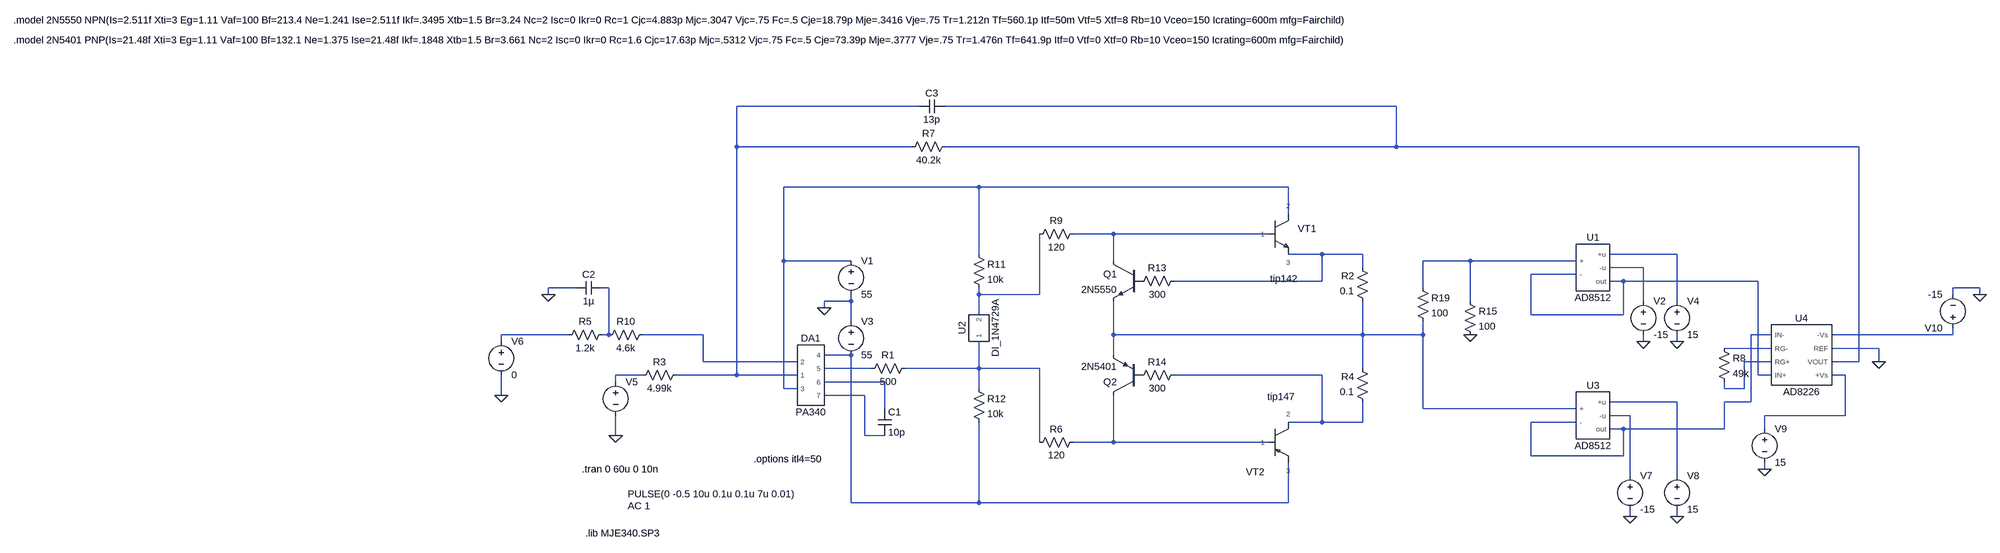
[diagram p0: schematic Draft15mk1.asc]
Draft15mk1.asc, the LTspice schematic file:
Version 4.1
SHEET 1 3012 1016
WIRE 448 -480 16 -480
WIRE 1584 -480 512 -480
WIRE 16 -384 16 -480
WIRE 432 -384 16 -384
WIRE 1584 -384 1584 -480
WIRE 1584 -384 512 -384
WIRE 2704 -384 1584 -384
WIRE 592 -288 128 -288
WIRE 1328 -288 592 -288
WIRE 1328 -224 1328 -288
WIRE 912 -176 816 -176
WIRE 1280 -176 912 -176
WIRE 592 -128 592 -288
WIRE 1408 -128 1328 -128
WIRE 1504 -128 1408 -128
WIRE 2272 -128 2112 -128
WIRE 128 -112 128 -288
WIRE 288 -112 128 -112
WIRE 912 -112 912 -176
WIRE 1760 -112 1648 -112
WIRE 2032 -112 1760 -112
WIRE 1504 -96 1504 -128
WIRE 2192 -96 2112 -96
WIRE 2032 -80 1904 -80
WIRE 1408 -64 1408 -128
WIRE 1408 -64 1056 -64
WIRE 2144 -64 2112 -64
WIRE 2464 -64 2144 -64
WIRE -368 -48 -432 -48
WIRE -288 -48 -304 -48
WIRE 1648 -48 1648 -112
WIRE 2992 -48 2928 -48
WIRE -432 -32 -432 -48
WIRE 592 -32 592 -48
WIRE 736 -32 736 -176
WIRE 736 -32 592 -32
WIRE 2928 -32 2928 -48
WIRE 2992 -32 2992 -48
WIRE 288 -16 288 -32
WIRE 288 -16 224 -16
WIRE 1760 -16 1760 -112
WIRE 2192 -16 2192 -96
WIRE 2272 -16 2272 -128
WIRE 224 0 224 -16
WIRE 592 16 592 -32
WIRE 1904 16 1904 -80
WIRE 2144 16 2144 -64
WIRE 2144 16 1904 16
WIRE 288 32 288 -16
WIRE -384 64 -544 64
WIRE -288 64 -288 -48
WIRE -288 64 -304 64
WIRE -64 64 -208 64
WIRE 912 64 912 -16
WIRE 1504 64 1504 -16
WIRE 1504 64 912 64
WIRE 1648 64 1648 32
WIRE 1648 64 1504 64
WIRE 2496 64 2448 64
WIRE 2928 64 2928 48
WIRE 2928 64 2640 64
WIRE -544 80 -544 64
WIRE 2192 80 2192 64
WIRE 2272 80 2272 64
WIRE 2496 96 2384 96
WIRE 2752 96 2640 96
WIRE 288 112 224 112
WIRE 912 112 912 64
WIRE -64 128 -64 64
WIRE 160 128 -64 128
WIRE 2496 128 2432 128
WIRE 2704 128 2704 -384
WIRE 2704 128 2640 128
WIRE 2752 128 2752 96
WIRE 336 144 224 144
WIRE 592 144 592 80
WIRE 592 144 416 144
WIRE 736 144 592 144
WIRE 1504 144 1504 64
WIRE -208 160 -272 160
WIRE 16 160 16 -384
WIRE 16 160 -128 160
WIRE 160 160 16 160
WIRE 1408 160 1056 160
WIRE 2464 160 2464 -64
WIRE 2496 160 2464 160
WIRE 2672 160 2640 160
WIRE -272 176 -272 160
WIRE 368 176 224 176
WIRE 128 192 128 -112
WIRE 160 192 128 192
WIRE 592 192 592 144
WIRE 2384 192 2384 176
WIRE 2432 192 2432 128
WIRE 2432 192 2384 192
WIRE -544 208 -544 160
WIRE 320 208 224 208
WIRE 2272 224 2112 224
WIRE 2448 224 2448 64
WIRE 2448 224 2384 224
WIRE 368 240 368 176
WIRE 1648 240 1648 64
WIRE 2032 240 1648 240
WIRE 2160 256 2112 256
WIRE 2672 256 2672 160
WIRE 2672 256 2480 256
WIRE 1408 272 1408 160
WIRE 1408 272 1328 272
WIRE 1504 272 1504 224
WIRE 1504 272 1408 272
WIRE 2032 272 1904 272
WIRE 2144 288 2112 288
WIRE 2384 288 2384 224
WIRE 2384 288 2144 288
WIRE 2480 288 2480 256
WIRE -272 304 -272 256
WIRE 320 304 320 208
WIRE 368 304 320 304
WIRE 736 320 736 144
WIRE 912 320 912 208
WIRE 912 320 816 320
WIRE 1280 320 912 320
WIRE 1904 352 1904 272
WIRE 2144 352 2144 288
WIRE 2144 352 1904 352
WIRE 2480 384 2480 368
WIRE 2160 400 2160 256
WIRE 2272 400 2272 224
WIRE 288 464 288 112
WIRE 592 464 592 272
WIRE 592 464 288 464
WIRE 1328 464 1328 368
WIRE 1328 464 592 464
WIRE 2160 496 2160 480
WIRE 2272 496 2272 480
FLAG -272 304 0
FLAG -432 -32 0
FLAG -544 208 0
FLAG 224 0 0
FLAG 2192 80 0
FLAG 2272 80 0
FLAG 2272 496 0
FLAG 2160 496 0
FLAG 2480 384 0
FLAG 2992 -32 0
FLAG 1760 64 0
FLAG 2752 128 0
SYMBOL PA340 192 160 R0
SYMATTR InstName DA1
SYMBOL res -112 144 R90
WINDOW 0 0 56 VBottom 2
WINDOW 3 32 56 VTop 2
SYMATTR InstName R3
SYMATTR Value 4.99k
SYMBOL cap 352 240 R0
SYMATTR InstName C1
SYMATTR Value 10p
SYMBOL res -192 48 R90
WINDOW 0 0 56 VBottom 2
WINDOW 3 32 56 VTop 2
SYMATTR InstName R10
SYMATTR Value 4.6k
SYMBOL voltage -272 160 R0
WINDOW 123 29 311 Left 2
WINDOW 39 0 0 Left 0
WINDOW 3 29 283 Left 2
SYMATTR Value2 AC 1
SYMATTR Value PULSE(0 -0.5 10u 0.1u 0.1u 7u 0.01)
SYMATTR InstName V5
SYMBOL res 832 304 R90
WINDOW 0 0 56 VBottom 2
WINDOW 3 62 56 VBottom 2
SYMATTR InstName R6
SYMATTR Value 120
SYMBOL tip142 1312 -176 R0
WINDOW 0 60 3 Bottom 2
WINDOW 3 5 91 Top 2
SYMATTR InstName VT1
SYMBOL tip147 1312 320 M180
WINDOW 0 -63 -55 Bottom 2
WINDOW 3 -1 93 Top 2
SYMATTR InstName VT2
SYMBOL res -288 48 R90
WINDOW 0 0 56 VBottom 2
WINDOW 3 32 56 VTop 2
SYMATTR InstName R5
SYMATTR Value 1.2k
SYMBOL cap -304 -64 R90
WINDOW 0 0 32 VBottom 2
WINDOW 3 32 32 VTop 2
SYMATTR InstName C2
SYMATTR Value 1µ
SYMBOL voltage -544 64 R0
WINDOW 123 0 0 Left 0
WINDOW 39 0 0 Left 0
SYMATTR InstName V6
SYMATTR Value 0
SYMBOL res 528 -400 R90
WINDOW 0 0 56 VBottom 2
WINDOW 3 32 56 VTop 2
SYMATTR InstName R7
SYMATTR Value 40.2k
SYMBOL res 832 -192 R90
WINDOW 0 0 56 VBottom 2
WINDOW 3 32 56 VTop 2
SYMATTR InstName R9
SYMATTR Value 120
SYMBOL cap 512 -496 R90
WINDOW 0 0 32 VBottom 2
WINDOW 3 32 32 VTop 2
SYMATTR InstName C3
SYMATTR Value 13p
SYMBOL voltage 288 16 R0
WINDOW 123 0 0 Left 0
WINDOW 39 0 0 Left 0
SYMATTR InstName V3
SYMATTR Value 55
SYMBOL voltage 288 -128 R0
WINDOW 123 0 0 Left 0
WINDOW 39 0 0 Left 0
SYMATTR InstName V1
SYMATTR Value 55
SYMBOL res 432 128 R90
WINDOW 0 0 56 VBottom 2
WINDOW 3 32 56 VTop 2
SYMATTR InstName R1
SYMATTR Value 500
SYMBOL res 1520 0 R180
WINDOW 0 36 76 Left 2
WINDOW 3 36 40 Left 2
SYMATTR InstName R2
SYMATTR Value 0.1
SYMBOL res 1520 240 R180
WINDOW 0 36 76 Left 2
WINDOW 3 36 40 Left 2
SYMATTR InstName R4
SYMATTR Value 0.1
SYMBOL res 576 -144 R0
SYMATTR InstName R11
SYMATTR Value 10k
SYMBOL res 576 176 R0
SYMATTR InstName R12
SYMATTR Value 10k
SYMBOL npn 976 -112 M0
SYMATTR InstName Q1
SYMATTR Value 2N5550
SYMBOL pnp 976 208 R180
SYMATTR InstName Q2
SYMATTR Value 2N5401
SYMBOL res 1072 -80 R90
WINDOW 0 0 56 VBottom 2
WINDOW 3 32 56 VTop 2
SYMATTR InstName R13
SYMATTR Value 300
SYMBOL res 1072 144 R90
WINDOW 0 0 56 VBottom 2
WINDOW 3 32 56 VTop 2
SYMATTR InstName R14
SYMATTR Value 300
SYMBOL DI_1N4729A 592 48 R270
SYMATTR InstName U2
SYMBOL AD8512 2064 -96 R0
SYMATTR InstName U1
SYMBOL voltage 2272 -32 R0
WINDOW 123 0 0 Left 0
WINDOW 39 0 0 Left 0
SYMATTR InstName V4
SYMATTR Value 15
SYMBOL AD8512 2064 256 R0
SYMATTR InstName U3
SYMBOL voltage 2272 384 R0
WINDOW 123 0 0 Left 0
WINDOW 39 0 0 Left 0
SYMATTR InstName V8
SYMATTR Value 15
SYMBOL voltage 2480 272 R0
WINDOW 123 0 0 Left 0
WINDOW 39 0 0 Left 0
SYMATTR InstName V9
SYMATTR Value 15
SYMBOL res 1744 -32 R0
SYMATTR InstName R15
SYMATTR Value 100
SYMBOL res 1632 -64 R0
SYMATTR InstName R19
SYMATTR Value 100
SYMBOL voltage 2192 -32 R0
WINDOW 123 0 0 Left 0
WINDOW 39 0 0 Left 0
SYMATTR InstName V2
SYMATTR Value -15
SYMBOL voltage 2160 384 R0
WINDOW 123 0 0 Left 0
WINDOW 39 0 0 Left 0
SYMATTR InstName V7
SYMATTR Value -15
SYMBOL voltage 2928 64 R180
WINDOW 123 0 0 Left 0
WINDOW 39 0 0 Left 0
SYMATTR InstName V10
SYMATTR Value -15
SYMBOL AD8226 2560 112 R0
SYMATTR InstName U4
SYMBOL res 2368 80 R0
SYMATTR InstName R8
SYMATTR Value 49k
TEXT -352 384 Left 2 !.tran 0 60u 0 10n
TEXT 56 360 Left 2 !.options itl4=50
TEXT -344 536 Left 2 !.lib MJE340.SP3
TEXT -1704 -824 Left 2 !.model 2N5550 NPN(Is=2.511f Xti=3 Eg=1.11 Vaf=100 Bf=213.4 Ne=1.241 Ise=2.511f Ikf=.3495 Xtb=1.5 Br=3.24 Nc=2 Isc=0 Ikr=0 Rc=1 Cjc=4.883p Mjc=.3047 Vjc=.75 Fc=.5 Cje=18.79p Mje=.3416 Vje=.75 Tr=1.212n Tf=560.1p Itf=50m Vtf=5 Xtf=8 Rb=10 Vceo=150 Icrating=600m mfg=Fairchild)
TEXT -1704 -776 Left 2 !.model 2N5401 PNP(Is=21.48f Xti=3 Eg=1.11 Vaf=100 Bf=132.1 Ne=1.375 Ise=21.48f Ikf=.1848 Xtb=1.5 Br=3.661 Nc=2 Isc=0 Ikr=0 Rc=1.6 Cjc=17.63p Mjc=.5312 Vjc=.75 Fc=.5 Cje=73.39p Mje=.3777 Vje=.75 Tr=1.476n Tf=641.9p Itf=0 Vtf=0 Xtf=0 Rb=10 Vceo=150 Icrating=600m mfg=Fairchild)

The netlist it stands for:
* Draft15mk1.asc
X§DA1 N013 N001 N003 N018 N020 N025 N026 PA340  ; pins 2 1 3 4 5 6 7
R3 N001 N022 4.99k
C1 N025 N026 10p
R10 N013 N010 4.6k
V5 N022 0 PULSE(0 -0.5 10u 0.1u 0.1u 7u 0.01) AC 1
R6 N029 N021 120
X§VT1 N003 N004 N005 tip142  ; pins 2 1 3
X§VT2 N018 N029 N023 tip147  ; pins 3 1 2
R5 N010 N012 1.2k
C2 N010 0 1µ
V6 N012 0 0
R7 N002 N001 40.2k
R9 N004 N011 120
C3 N002 N001 13p
V3 0 N018 55
V1 N003 0 55
R1 N021 N020 500
R2 N014 N005 0.1
R4 N023 N014 0.1
R11 N003 N011 10k
R12 N021 N018 10k
Q1 N004 P001 N014 0 2N5550
Q2 N029 P002 N014 0 2N5401
R13 N005 P001 300
R14 N023 P002 300
X§U2 N021 N011 DI_1N4729A  ; pins 1 2
X§U1 N007 N009 N006 N008 N009 AD8512  ; pins + - +u -u out
V4 N006 0 15
X§U3 N014 N015 N027 N028 N015 AD8512  ; pins + - +u -u out
V8 N027 0 15
V9 N024 0 15
R15 N007 0 100
R19 N007 N014 100
V2 N008 0 -15
V7 N028 0 -15
V10 N016 0 -15
X§U4 N015 N017 N019 N009 N016 0 N002 N024 AD8226  ; pins IN- RG- RG+ IN+ -Vs REF VOUT +Vs
R8 N017 N019 49k
.model NPN NPN
.model PNP PNP
.lib standard.bjt
.tran 0 60u 0 10n
.options itl4=50
.lib MJE340.SP3
.model 2N5550 NPN(Is=2.511f Xti=3 Eg=1.11 Vaf=100 Bf=213.4 Ne=1.241 Ise=2.511f Ikf=.3495 Xtb=1.5 Br=3.24 Nc=2 Isc=0 Ikr=0 Rc=1 Cjc=4.883p Mjc=.3047 Vjc=.75 Fc=.5 Cje=18.79p Mje=.3416 Vje=.75 Tr=1.212n Tf=560.1p Itf=50m Vtf=5 Xtf=8 Rb=10 Vceo=150 Icrating=600m mfg=Fairchild)
.model 2N5401 PNP(Is=21.48f Xti=3 Eg=1.11 Vaf=100 Bf=132.1 Ne=1.375 Ise=21.48f Ikf=.1848 Xtb=1.5 Br=3.661 Nc=2 Isc=0 Ikr=0 Rc=1.6 Cjc=17.63p Mjc=.5312 Vjc=.75 Fc=.5 Cje=73.39p Mje=.3777 Vje=.75 Tr=1.476n Tf=641.9p Itf=0 Vtf=0 Xtf=0 Rb=10 Vceo=150 Icrating=600m mfg=Fairchild)
.lib PA340_Pspice.LIB
.lib TIP142.cir
.lib TIP147.cir
.lib 1N4729A.cir
.lib C:\Users\User\Downloads\ad8512.cir
.lib \\ARX-704\Line-2-ARX\Áëîê áàçû - Ïîäëîæêè\Dradt15mk1\ad8226.cir
.backanno
.end